# Altium schematic sheet Main.SchDoc: RFID Access Control System
size 294 x 281 mm; DrawnBy: Avishka C. Herath; Revision: 1.9; SheetNumber: 2; SheetTotal: 2; Index Number: 200212F
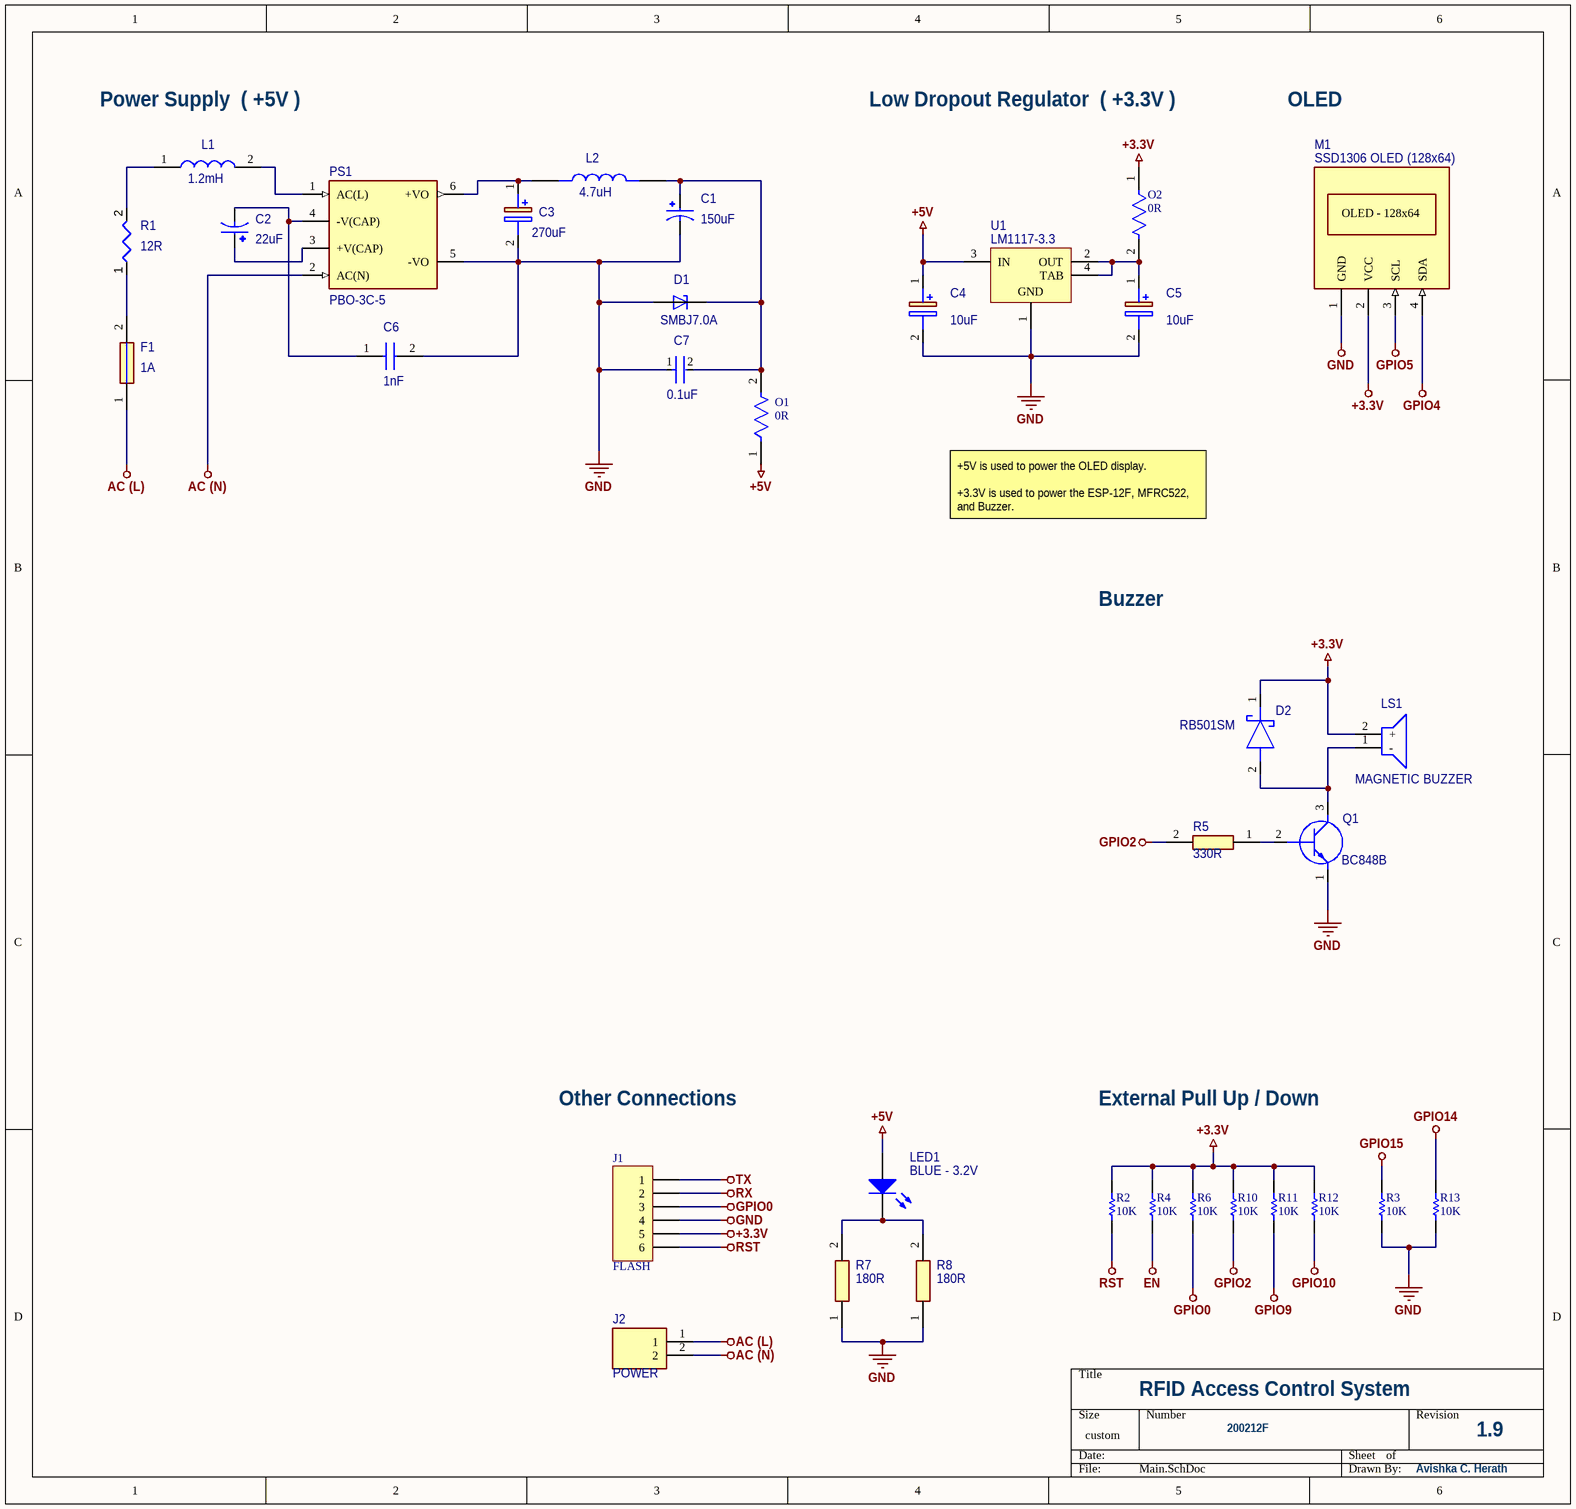
[diagram p0: Main.SchDoc]

## Parts
C1  150uF  [CAPPRD500W60D800H1150]
C2  22uF  [CAPPRD750W80D1600H2500]
C3  270uF  [CAPPRD250W65D630H900]
C4  10uF  [T491B]
C5  10uF  [T491B]
C6  1nF  [B32529C8102J]
C7  0.1uF  [FP-CL10-0_1-MFG]
D1  SMBJ7.0A  [DIOM4336X265N]
D2  RB501SM  [RB501SM30FHT2R]
F1  1A  [SS5H1AAPH]
J1  FLASH  [My_1X06]
J2  POWER  [TB00250002BE]
L1  1.2mH  [RLB9012122KL]
L2  4.7uH  [IND_ASPI-0615FS-4R7M-T2]
LED1  BLUE - 3.2V  [3528]
LS1  MAGNETIC BUZZER  [CMI1295IC0385T]
M1  SSD1306 OLED (128x64)  [SSD1306 OLED (128x64)-Footprint-1]
O1  0R  [FP-RC0805-MFG]
O2  0R  [FP-RC0805-MFG]
PS1  PBO-3C-5  [CONV_PBO-3C-5]
Q1  BC848B  [SOT95P240X120-3N]
R1  12R  [WA84-12RJI-Footprint-1]
R2  10K  [RESC2013X60X35ML10T20]
R3  10K  [RESC2013X60X35ML10T20]
R4  10K  [RESC2013X60X35ML10T20]
R5  330R  [RESC2012X60N]
R6  10K  [RESC2013X60X35ML10T20]
R7  180R  [RESC2012X60N]
R8  180R  [RESC2012X60N]
R10  10K  [RESC2013X60X35ML10T20]
R11  10K  [RESC2013X60X35ML10T20]
R12  10K  [RESC2013X60X35ML10T20]
R13  10K  [RESC2013X60X35ML10T20]
U1  LM1117-3.3  [DCY0004A_L]

## Nets
+3.3V: D2.1(K) J1.5 LS1.2(+) M1.2(VCC) O2.1 R2.1 R4.1 R6.2 R10.2 R11.2 R12.2
+5V: C4.1(+) LED1.2(A) O1.1 U1.3(IN)
AC (L): F1.1 J2.1
AC (N): J2.2 PS1.2(AC(N))
EN: R4.2
GND: C1.N C3.2(-) C4.2(-) C5.2(-) C6.2 C7.1 D1.A J1.4 M1.1(GND) PS1.5(-VO) Q1.1(E) R3.2 R7.1 R8.1 R13.2 U1.1(GND)
GPIO0: J1.3 R6.1
GPIO2: R5.2 R10.1
GPIO4: M1.4(SDA)
GPIO5: M1.3(SCL)
GPIO9: R11.1
GPIO10: R12.1
GPIO14: R13.1
GPIO15: R3.1
RST: J1.6 R2.2
RX: J1.2
TX: J1.1
NetC1_P: C1.P C7.2 D1.C L2.2 O1.2
NetC2_N: C2.N C6.1 PS1.4(-V(CAP))
NetC2_P: C2.P PS1.3(+V(CAP))
NetC3_1: C3.1(+) L2.1 PS1.6(+VO)
NetC5_1: C5.1(+) O2.2 U1.2(OUT) U1.4(TAB)
NetD2_2: D2.2(A) LS1.1(-) Q1.3(C)
NetF1_2: F1.2 R1.1
NetL1_1: L1.1 R1.2
NetL1_2: L1.2 PS1.1(AC(L))
NetLED1_1: LED1.1(K) R7.2 R8.2
NetQ1_2: Q1.2(B) R5.1

Not connected (* = marked no-connect by the designer): PS1 4_2(-V(CAP)) 5_2(-VO)

## Notes on the sheet
- Power Supply  ( +5V )
- Low Dropout Regulator  ( +3.3V )
- OLED
- +5V is used to power the OLED display.
  +3.3V is used to power the ESP-12F, MFRC522, and Buzzer.
- Buzzer
- Other Connections
- External Pull Up / Down
- (in symbol CMP-00026-00001-2) OLED - 128x64

## Library data of the parts
C1 = EEUFR1V221B: FR-A; MF: {'manufacturer': u'Panasonic'}; MP: UHE1V151MPD1TD; Value: *; Price: None; Availability: Unavailable; Package: None
C2 = EEUTP1E272B: Aluminum Electrolytic Capacitors - Radial Leaded; MF: Nichicon; MP: UVR2W220MHD; Value: 22uF; Price: None; Availability: Unavailable; Package: Bulk; ComponentLink1Description: Mouser; ComponentLink1URL: https://www.mouser.com/ProductDetail/Nichicon/UVR2W220MHD?qs=%252BlpsHQzXjw%2F%252B5drQqN1W8w%3D%3D; Supplier 1: Rs; Supplier Part Number 1: 5201365
C3 = 6SEPC560MW+TSS: Aluminum Organic Polymer Capacitors; Manufacturer_Name: KEMET; Manufacturer_Part_Number: A750EM277M1CAAE015; Datasheet Link: http://industrial.panasonic.com/cdbs/www-data/pdf/AAB8000/AAB8000C247.pdf; Height: 9mm; Mouser Part Number: 667-6SEPC560MW+TSS; Mouser Price/Stock: https://www.mouser.co.uk/ProductDetail/Panasonic/6SEPC560MW%2bTSS?qs=OE1iw1LrrPGkg%2Fufb0Bk8Q%3D%3D; Arrow Part Number: 6SEPC560MW+TSS; Arrow Price/Stock: https://www.arrow.com/en/products/6sepc560mwtss/panasonic?region=nac
C4 C5 = T491B106M010AT: Capacitor Polarised; Manufacturer_Name: KEMET; Datasheet Link: https://content.kemet.com/datasheets/KEM_T2005_T491.pdf; Height: 2.1mm; Manufacturer_Part_Number: T491B106M010AT; Mouser Part Number: 80-T491B106M010; Arrow Part Number: T491B106M010AT; Arrow Price/Stock: https://www.arrow.com/en/products/t491b106m010at/kemet-corporation?region=nac
C6 = B32529C8102J: Capacitor; Manufacturer_Name: TDK; Datasheet Link: https://componentsearchengine.com/Datasheets/1/B32529C8102J.pdf; Height: 6.5mm; Manufacturer_Part_Number: B32529C8102J; Mouser Part Number: 871-B32529C8102J; Mouser Price/Stock: https://www.mouser.co.uk/ProductDetail/EPCOS-TDK/B32529C8102J?qs=CveI%2FUwZDBKgVtfngCVMDw%3D%3D
C7 = CMP-13271-000011-1: CAP CER 0.1UF 50V X7R 0603; Manufacturer: Samsung Electro-Mechanics America, Inc; Manufacturer Part Number: CL10B104JB8NNNC; Value: 100nF; Material: Ceramic; Temperature Coefficient: 15%; Tolerance: 5%; Ipc Land Pattern Name: CAPC16080X80; Device Class L1: Passive Components; Digikey Description: CAP CER 0.1UF 50V X7R 0603; Voltage Rating: 50V; Height: 0.9mm; ComponentLink2Description: Datasheet; Device Class L2: Capacitors; ComponentLink2URL: http://www.samsungsem.com/kr/support/product-search/mlcc/__icsFiles/afieldfile/2019/06/18/CL10B104JB8NNNC-19.pdf; Temperature Characteristic: X7R; Temperature Range High: +125°C; Lead Free: Yes; Temperature Range Low: -55°C; Category: Cap; Package: CL10-0.1; Temperature: -55°C to +125°C; Octopart: https://octopart.com/cl10b104jb8nnnc-samsung-9302151; Device Class L3: Ceramic Capacitors; RoHS: TRUE; Automotive: No; Capacitance: 100nF
D1 = SMBJ7.0A: MF: {'manufacturer': u'Littelfuse'}; Value: *; Price: None; Availability: Unavailable; Package: None; MP: SMBJ7.0A
D2 = RB501SM-30FHT2R: Schottky Diode; Manufacturer_Name: ROHM Semiconductor; Datasheet Link: https://fscdn.rohm.com/en/products/databook/datasheet/discrete/diode/schottky_barrier/rb501sm-30fht2r-e.pdf; Height: 0.6mm; Manufacturer_Part_Number: RB501SM-30FHT2R; Mouser Part Number: 755-RB501SM-30FHT2R; Mouser Price/Stock: https://www.mouser.co.uk/ProductDetail/ROHM-Semiconductor/RB501SM-30FHT2R?qs=4v%252BiZTmLVHEIefGC27iswg%3D%3D
F1 = CMP-018-000000-1: Fuse; Manufacturer_Name: Eaton; Datasheet Link: https://www.eaton.com/content/dam/eaton/products/electronic-components/resources/data-sheet/eaton-ss-5h-subminiature-radial-leaded-time-delay-fuses-data-sheet.pdf; Height: 8.55mm; Arrow Price/Stock: https://www.arrow.com/en/products/ss-5h-1a-aph/eaton?region=nac; Pin Count: 2; Source: SamacSys.SchLib; Design Item ID: SS-5H-1A-APH; Mouser Part Number: 504-SS-5H-1A-APH; Manufacturer_Part_Number: SS-5H-1A-APH; Arrow Part Number: SS-5H-1A-APH; Component Type: Standard; Mouser Price/Stock: https://www.mouser.co.uk/ProductDetail/Bussmann-Eaton/SS-5H-1A-APH?qs=uEhifBLpbD3ldHjMqFUUYA%3D%3D
J1 = Header 6: Header, 6-Pin; ASiD Part Number: Header 6-AS
J2 = TB002-500-02BE: Connector; Manufacturer_Name: CUI Devices; Datasheet Link: https://eu.mouser.com/datasheet/2/670/tb002_500-1550579.pdf; Height: 10.4mm; Manufacturer_Part_Number: TB002-500-02BE; Mouser Part Number: 490-TB002-500-02BE; Mouser Price/Stock: https://www.mouser.co.uk/ProductDetail/CUI-Devices/TB002-500-02BE?qs=vLWxofP3U2x9716kcgva%2Fw%3D%3D; Arrow Part Number: TB002-500-02BE; Arrow Price/Stock: https://www.arrow.com/en/products/tb002-500-02be/cui-devices?region=nac
L1 = RLB9012-122KL: Inductor; Manufacturer_Name: Bourns; Datasheet Link: https://datasheet.datasheetarchive.com/originals/dk/DKDS-12/225018.pdf; Height: 12.2mm; Manufacturer_Part_Number: RLB9012-122KL; Mouser Part Number: 652-RLB9012-122KL; Mouser Price/Stock: https://www.mouser.co.uk/ProductDetail/Bourns/RLB9012-122KL?qs=dB0LedT%252BmmC%2Fvhpfl8NA4g%3D%3D; Arrow Part Number: RLB9012-122KL; Arrow Price/Stock: https://www.arrow.com/en/products/rlb9012-122kl/bourns?region=nac
L2 = ASPI-0615FS-4R7M-T2: MF: {'manufacturer': u'Abracon'}; Value: *; Price: None; Availability: Unavailable; Package: None; MP: ASPI-0615FS-4R7M-T2
LED1 = CMP-1429-00005-1: SMD mono-color Top LED, WL-SMTW, Blue; PartNumber: 150141BS73100; Manufacturer: Wuerth Elektronik; ComponentLink2Description: Datasheet; ComponentLink1Description: Manufacturer URL; ComponentLink2URL: http://katalog.we-online.com/led/datasheet/150141BS73100.pdf; ComponentLink1URL: http://www.we-online.com; PackageReference: 3528; Color: Blue
LS1 = CMI-1295IC-0385T: Loudspeaker or Buzzer; Manufacturer_Name: CUI Devices; Datasheet Link: https://www.arrow.com/en/products/cmi-1295ic-0385t/cui-devices; Height: 9.7mm; Manufacturer_Part_Number: CMI-1295IC-0385T; Mouser Part Number: 490-CMI-1295IC-0385T; Mouser Price/Stock: https://www.mouser.co.uk/ProductDetail/CUI-Devices/CMI-1295IC-0385T?qs=OlC7AqGiEDk2g42uzfEhlg%3D%3D; Arrow Part Number: CMI-1295IC-0385T; Arrow Price/Stock: https://www.arrow.com/en/products/cmi-1295ic-0385t/cui-devices?region=nac
M1 = CMP-00026-00001-2: The OLED display module is a small 0.96" diagonal display made of individual blue OLED pixels that can be turned on or off by the controller chip. It does not require a backlight and is compatible with I2C communication through the SSD1306 driver chip.; Number of Pixels: 128 × 64; Size: 0.96"; Interface: I2C; Dimension: 27.8 x27.3x 4.3 mm
O1 O2 = CMP-2001-04570-2: RES SMD 0 OHM JUMPER 1/8W 0805; Manufacturer: Yageo; Manufacturer Part Number: RC0805FR-070RL; Resistance: 0Ω; Value: 0Ω; Power Rating: 0.125W; Tolerance: 1%; Voltage Rating: 150V; RoHS: TRUE; Device Class L2: Resistors; Composition: Thick Film; Device Class L1: Passive Components; Height: 0.6mm; Category: Res; Automotive: No; Device Class L3: Chip SMD Resistors; ComponentLink2URL: http://www.yageo.com/documents/recent/PYu-RC_Group_51_RoHS_L_10.pdf; Octopart: https://octopart.com/rc0805fr-070rl-yageo-9293404; Temperature Range High: +155°C; Ipc Land Pattern Name: RESC200125X50; Footprint Url: http://www.yageo.com/exep/pages/download/literatures/PYu-R_Mount_10.pdf; Series: RC_L; Digikey Description: RES SMD 0 OHM JUMPER 1/8W 0805; Temperature Range Low: -55°C; Temperature: -55°C to +155°C; Package: RC0805; ComponentLink2Description: Datasheet; Lead Free: Yes
PS1 = PBO-3C-5: MF: {'manufacturer': u'CUI'}; Value: *; Price: None; Availability: Unavailable; Package: None; MP: PBO-3C-5
Q1 = BC848BHZGT116: Transistor BJT NPN; Manufacturer_Name: ROHM Semiconductor; Datasheet Link: https://componentsearchengine.com/Datasheets/2/BC848BHZGT116.pdf; Height: 1.2mm; Manufacturer_Part_Number: BC848BHZGT116; Mouser Part Number: 755-BC848BHZGT116; Mouser Price/Stock: https://www.mouser.co.uk/ProductDetail/ROHM-Semiconductor/BC848BHZGT116?qs=zGux8KhMp6JnZZvroKxywg%3D%3D
R1 = CMP-009-00177-4: Through Hole Wirewound Resistor, Wa80 Series, 12 Ohm, 3 W, - 5%, 100 V, Axial Leaded Rohs Compliant: Yes; Body Length: 14.5mm; Lead Length: 24.55mm; Lead Diameter: 0.8mm; Body Diameter: 5.2mm; Case/Package: Axial
R2-R4 R6 R10-R13 = CMP-009-00179-1: Res Thick Film 0805 10K Ohm 1% 0.125W(1/8W) +/-100ppm/C Epoxy Pad SMD T/R
R5 = RC0805FR-07330RL: Resistor; Manufacturer_Name: KEMET; Datasheet Link: http://www.yageo.com/documents/recent/PYu-RC_Group_51_RoHS_L_10.pdf; Height: 0.6mm; Manufacturer_Part_Number: RC0805FR-07330RL; Mouser Part Number: 603-RC0805FR-07330RL; Mouser Price/Stock: https://www.mouser.com/Search/Refine.aspx?Keyword=603-RC0805FR-07330RL
R7 R8 = RC0805FR-07180RL: Resistor; Manufacturer_Name: KEMET; Datasheet Link: http://www.yageo.com/documents/recent/PYu-RC_Group_51_RoHS_L_10.pdf; Height: 0.6mm; Manufacturer_Part_Number: RC0805FR-07180RL; Mouser Part Number: 603-RC0805FR-07180RL; Mouser Price/Stock: https://www.mouser.co.uk/ProductDetail/Yageo/RC0805FR-07180RL/?qs=fRxXYNj8ftG7jMu9i6mDhQ%3D%3D; Arrow Part Number: RC0805FR-07180RL; Arrow Price/Stock: https://www.arrow.com/en/products/rc0805fr-07180rl/yageo
U1 = CMP-0062-01639-4: 800mA Low-Dropout Linear Regulator, 4-pin SOT-223, Pb-Free; PartNumber: LM1117MPX-3.3/NOPB; Manufacturer: Texas Instruments; High-Reliability: Y; PowerWise: N; PackageTopMarking: XYTT*N05A; CompType: LDO IC; ComponentLink1URL: http://www.ti.com/general/docs/lit/getliterature.tsp?genericPartNumber=LM1117-N&fileType=pdf; ComponentLink1Description: Datasheet URL; PinCount: 4; Code_JEDEC: TO-261-AA; PackageDescription: Molded SOT-223, 6.50 x 3.56 x 1.6mm Body, 4 Lead, 2.3mm Pitch; PackageReference: DCY0004A; RoHS: Y; Code_IPC: SOT223-4